# EAGLE schematic ERC_Sch (EAGLE 9.6.2)
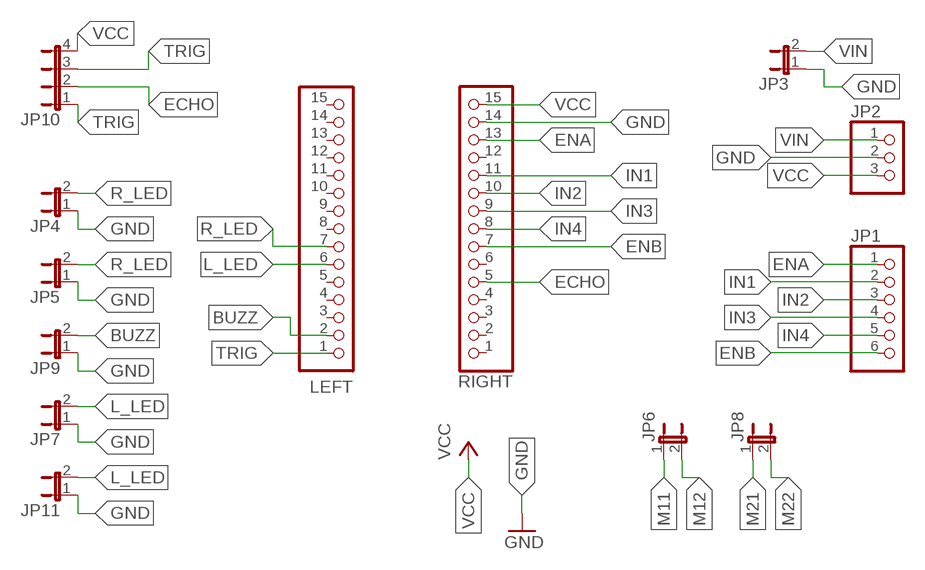
[diagram p0: schematic, sheet 1]

## Parts
JP1  PINHD-1X6  [1X06]
JP2  PINHD-1X3  [1X03]
JP3  JP1E  [JP1]
JP4  JP1E  [JP1]
JP5  JP1E  [JP1]
JP6  JP1E  [JP1]
JP7  JP1E  [JP1]
JP8  JP1E  [JP1]
JP9  JP1E  [JP1]
JP10  JP4E  [JP4]
JP11  JP1E  [JP1]
LEFT  PINHD-1X15  [1X15]
RIGHT  PINHD-1X15  [1X15]

## Nets
BUZZ: JP9.2 LEFT.2
ECHO: JP10.2 RIGHT.5
ENA: JP1.1 RIGHT.13
ENB: JP1.6 RIGHT.7
GND: JP2.2 JP3.1 JP4.1 JP5.1 JP7.1 JP9.1 JP11.1 RIGHT.14
IN1: JP1.2 RIGHT.11
IN2: JP1.3 RIGHT.10
IN3: JP1.4 RIGHT.9
IN4: JP1.5 RIGHT.8
L_LED: JP7.2 JP11.2 LEFT.6
M11: JP6.1
M12: JP6.2
M21: JP8.1
M22: JP8.2
R_LED: JP4.2 JP5.2 LEFT.7
TRIG: JP10.1 JP10.3 LEFT.1
VCC: JP2.3 JP10.4 RIGHT.15
VIN: JP2.1 JP3.2
Unconnected: LEFT.3 LEFT.4 LEFT.5 LEFT.8 LEFT.9 LEFT.10 LEFT.11 LEFT.12 LEFT.13 LEFT.14 LEFT.15 RIGHT.1 RIGHT.2 RIGHT.3 RIGHT.4 RIGHT.6 RIGHT.12

## Library data of the parts
JP1 = adafruit:PINHD-1X6: PIN HEADER
JP2 = adafruit:PINHD-1X3: PIN HEADER
JP3-JP9 JP11 = jumper:JP1E: JUMPER
JP10 = jumper:JP4E: JUMPER
LEFT RIGHT = adafruit:PINHD-1X15: PIN HEADER